# EAGLE schematic BarBot_Wristband (EAGLE 8.0.1)
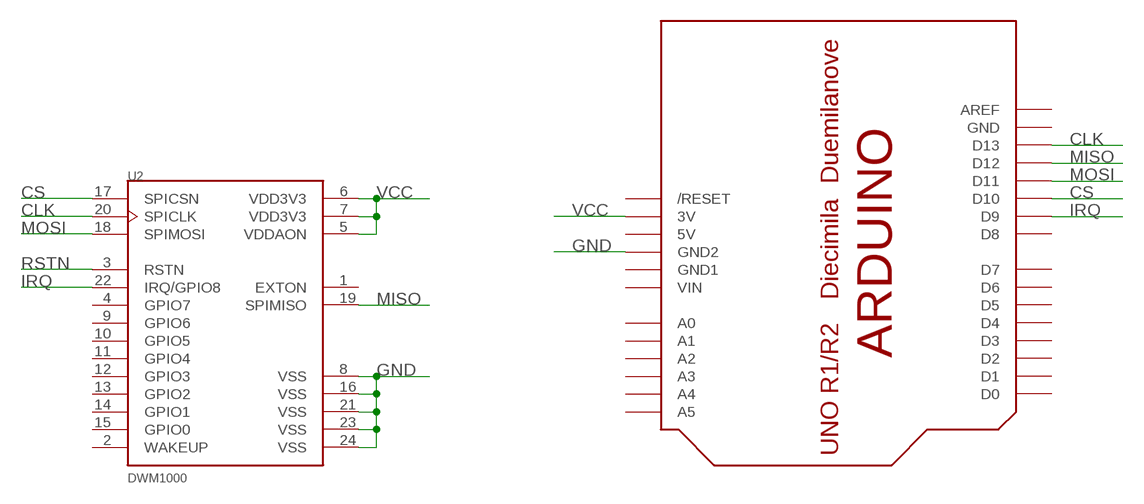
[diagram p0: schematic, sheet 1]

## Parts
U2  DWM1000  [XCVR_DWM1000]
U$1  ARDUINO-BPLACE  [ARDUINO-BPLACE]

## Nets
CLK: U2.20(SPICLK) U$1.D13
CS: U2.17(SPICSN) U$1.D10
GND: U2.8(VSS) U2.16(VSS) U2.21(VSS) U2.23(VSS) U2.24(VSS) U$1.GND2
IRQ: U2.22(IRQ/GPIO8) U$1.D9
MISO: U2.19(SPIMISO) U$1.D12
MOSI: U2.18(SPIMOSI) U$1.D11
RSTN: U2.3(RSTN)
VCC: U2.5(VDDAON) U2.6(VDD3V3) U2.7(VDD3V3) U$1.3V
Unconnected: U2.1(EXTON) U2.2(WAKEUP) U2.4(GPIO7) U2.9(GPIO6) U2.10(GPIO5) U2.11(GPIO4) U2.12(GPIO3) U2.13(GPIO2) U2.14(GPIO1) U2.15(GPIO0) U$1.A0 U$1.A1 U$1.A2 U$1.A3 U$1.A4 U$1.A5 U$1.AREF U$1.D0 U$1.D1 U$1.D2 U$1.D3 U$1.D4 U$1.D5 U$1.D6 U$1.D7 U$1.D8 U$1.RESET(/RESET)

## Power pins joined to a net without a drawn wire
5V: U$1.5V
GND: U$1.GND
GND1: U$1.GND1
VIN: U$1.VIN

## Library data of the parts
U2 = DWM1000:DWM1000: Mod Ieee802.15.4-2011 Uwb Txrx; AVAILABILITY: Good; DESCRIPTION: Mod Ieee802.15.4-2011 Uwb Txrx; MF: Decawave; MP: DWM1000; PACKAGE: None; PRICE: 23.36 USD
U$1 = adafruit:ARDUINO: Arduino Diecimila/Duemilanove Make a shield with ease, this package has all the named pins as well as the two mounting drill holes and an outline of the USB and DC power connector. The outline is on the DIMENSION layer, so if your board house uses it they will cut the outline to match. http://www.ladyada.net/library/pcb/eaglelibrary.html